# EasyEDA Pro project ProPrj_AUDIO CONTROLER_2026-01-01.epro, schematic Schematic1
Board Name: Board1; Create Date: 2025-12-11; Page Name: P1; Project Name: AUDIO CONTROLER; Schematic Name: Schematic1; Update Date: 2025-12-16; Company: EasyEDA.com; Page Size: A4; Version: V1.0
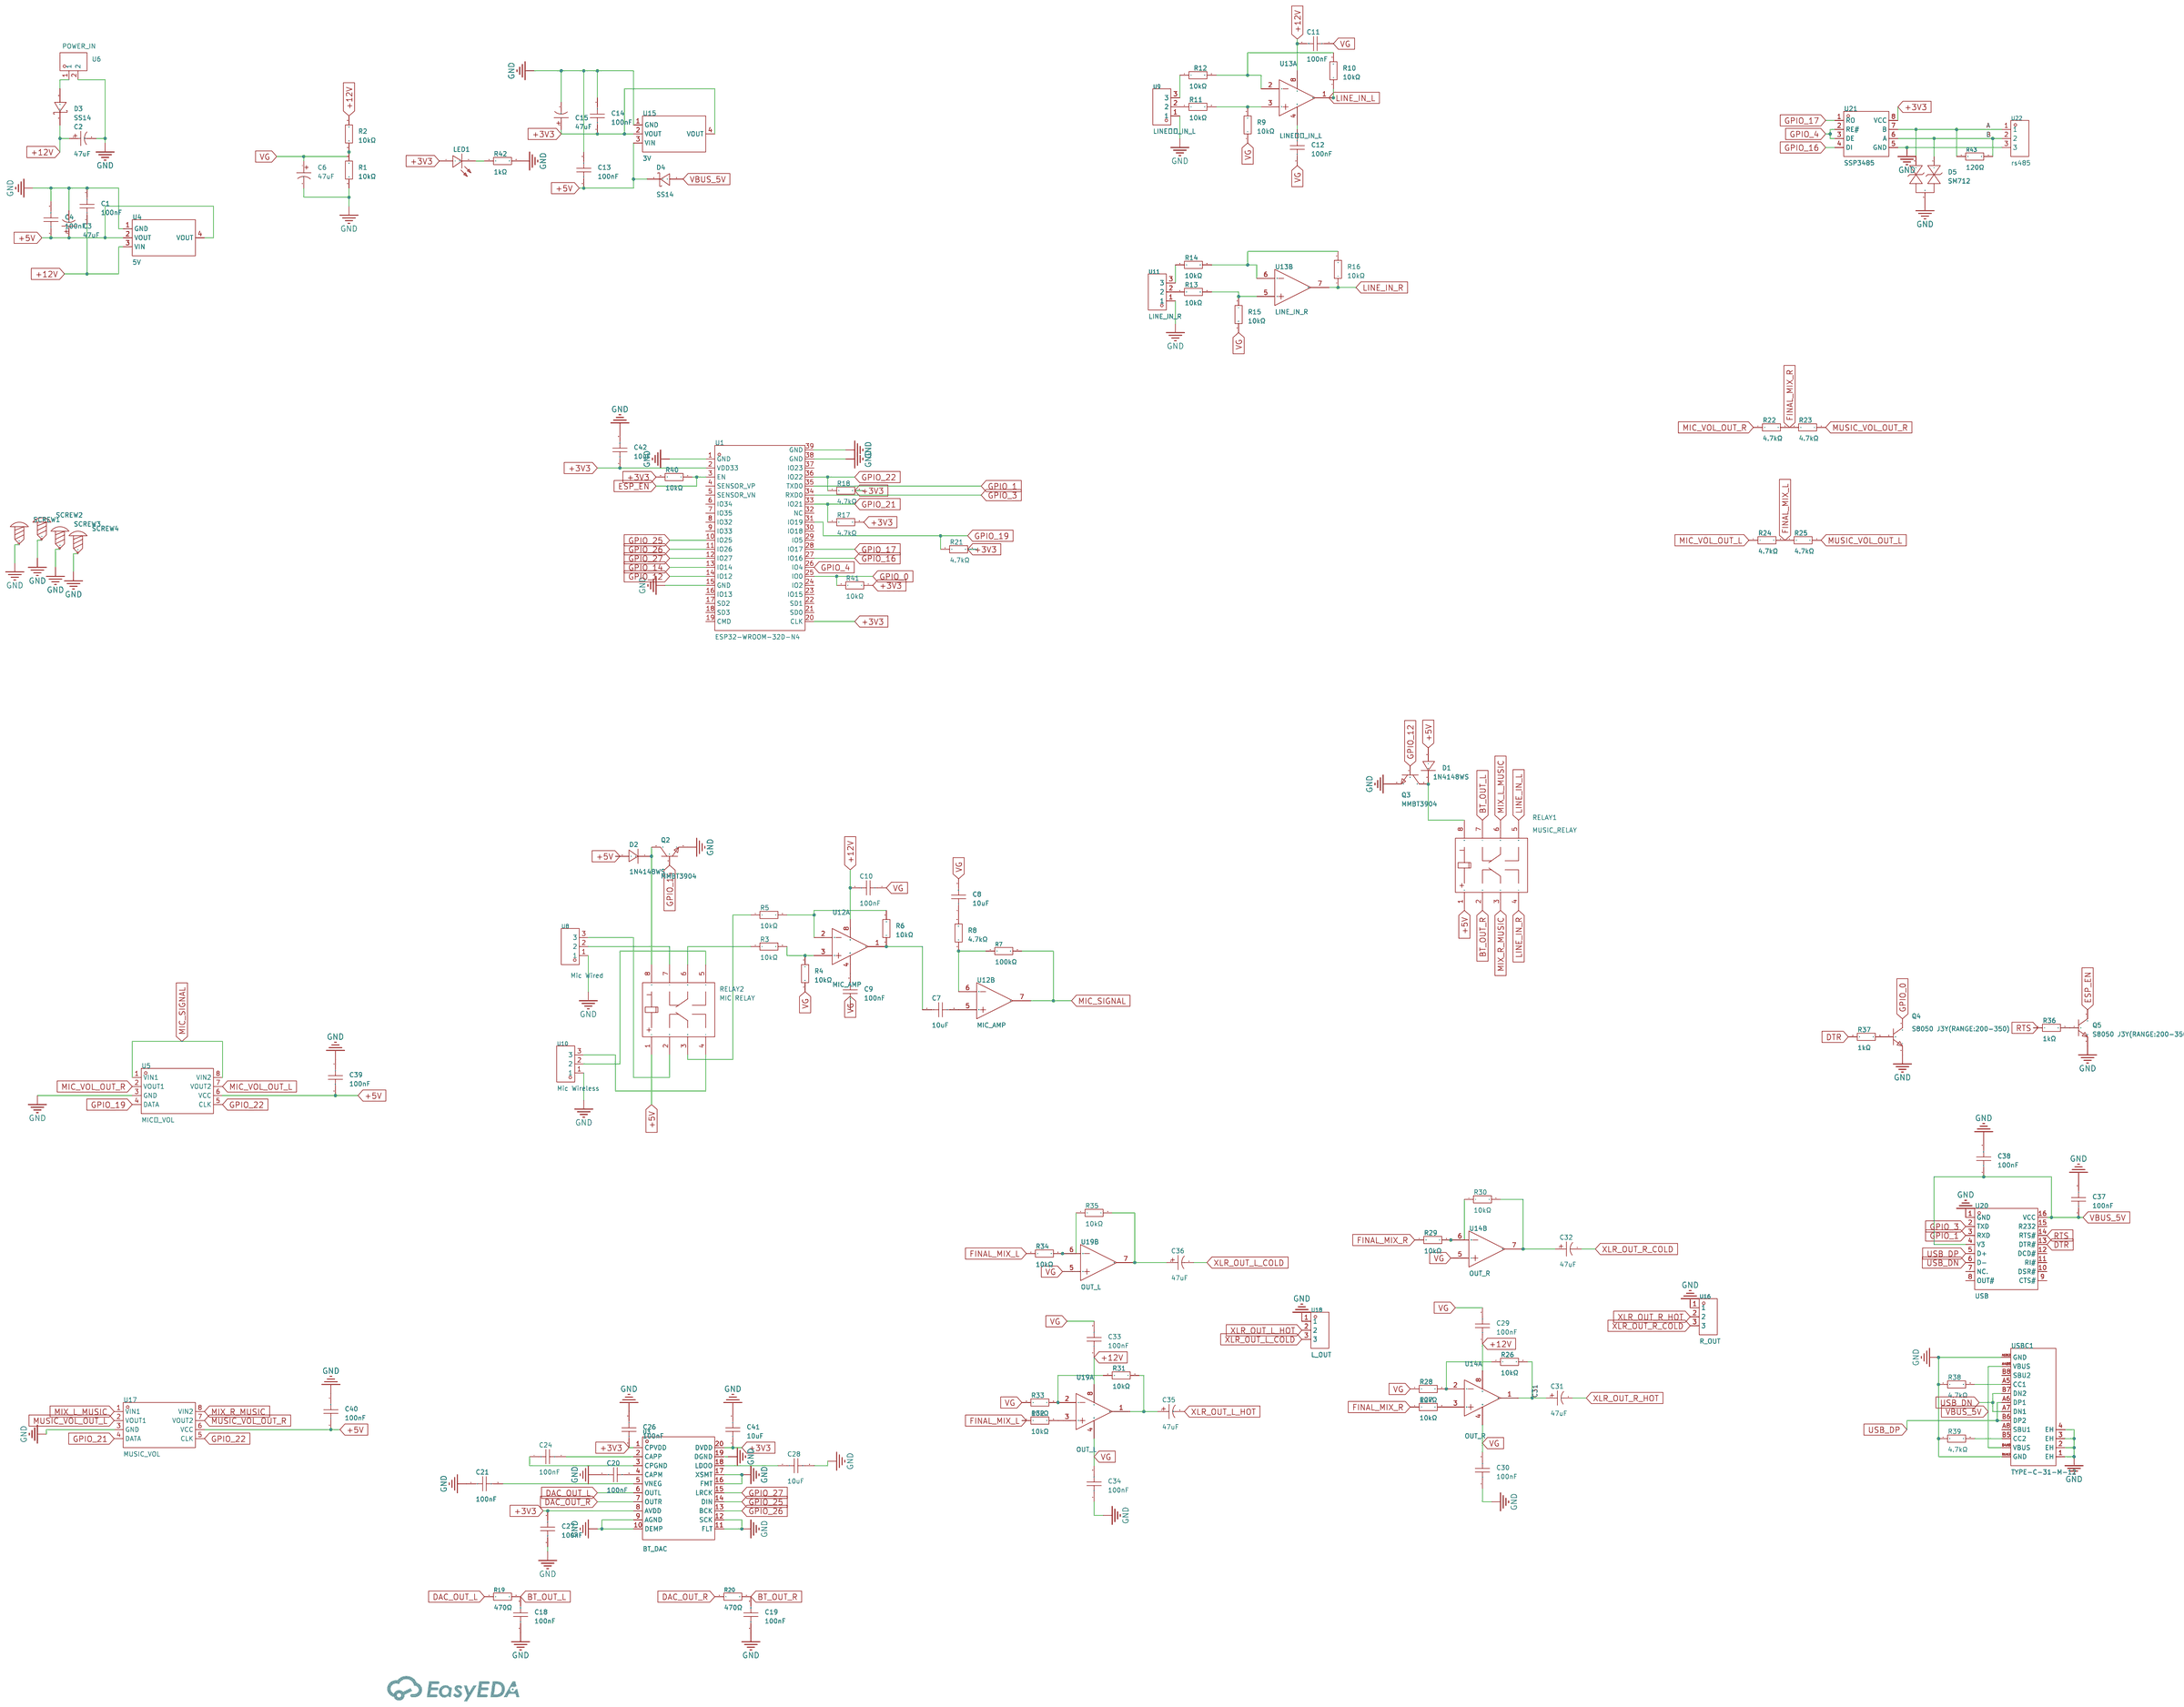
[diagram p0: schematic sheet]

## Parts
C1  100nF  [C0805]
C2  47uF  [CAP-SMD_BD6.3-L6.6-W6.6-LS7.6-FD]
C3  47uF  [CAP-SMD_BD6.3-L6.6-W6.6-LS7.6-FD]
C4  100nF  [C0805]
C6  47uF  [CAP-SMD_BD6.3-L6.6-W6.6-LS7.6-FD]
C7  10uF  [C0805]
C8  10uF  [C0805]
C9  100nF  [C0805]
C10  100nF  [C0805]
C11  100nF  [C0805]
C12  100nF  [C0805]
C13  100nF  [C0805]
C14  100nF  [C0805]
C15  47uF  [CAP-SMD_BD6.3-L6.6-W6.6-LS7.6-FD]
C18  100nF  [C0805]
C19  100nF  [C0805]
C20  100nF  [C0805]
C21  100nF  [C0805]
C24  100nF  [C0805]
C26  100nF  [C0805]
C27  100nF  [C0805]
C28  10uF  [C0805]
C29  100nF  [C0805]
C30  100nF  [C0805]
C31  47uF  [CAP-SMD_BD6.3-L6.6-W6.6-LS7.6-FD]
C32  47uF  [CAP-SMD_BD6.3-L6.6-W6.6-LS7.6-FD]
C33  100nF  [C0805]
C34  100nF  [C0805]
C35  47uF  [CAP-SMD_BD6.3-L6.6-W6.6-LS7.6-FD]
C36  47uF  [CAP-SMD_BD6.3-L6.6-W6.6-LS7.6-FD]
C37  100nF  [C0805]
C38  100nF  [C0805]
C39  100nF  [C0805]
C40  100nF  [C0805]
C41  10uF  [C0805]
C42  10uF  [C0805]
D1  1N4148WS  [SOD-323_L1.8-W1.3-LS2.5-RD]
D2  1N4148WS  [SOD-323_L1.8-W1.3-LS2.5-RD]
D3  SS14  [SMA_L4.2-W2.6-LS5.0-RD_1]
D4  SS14  [SMA_L4.2-W2.6-LS5.0-RD_1]
D5  SM712  [SOT-23-3_L2.9-W1.3-P1.90-LS2.4-BR]
LED1  KT-0603W  [LED0603-R-RD_WHITE]
Q2  MMBT3904  [SOT-23-3_L3.0-W1.7-P0.95-LS2.9-BR]
Q3  MMBT3904  [SOT-23-3_L3.0-W1.7-P0.95-LS2.9-BR]
Q4  S8050 J3Y(RANGE:200-350)  [SOT-23-3_L3.0-W1.7-P0.95-LS2.9-BR]
Q5  S8050 J3Y(RANGE:200-350)  [SOT-23-3_L3.0-W1.7-P0.95-LS2.9-BR]
R1  10kΩ  [R0805]
R2  10kΩ  [R0805]
R3  10kΩ  [R0805]
R4  10kΩ  [R0805]
R5  10kΩ  [R0805]
R6  10kΩ  [R0805]
R7  100kΩ  [R0805]
R8  4.7kΩ  [R0805]
R9  10kΩ  [R0805]
R10  10kΩ  [R0805]
R11  10kΩ  [R0805]
R12  10kΩ  [R0805]
R13  10kΩ  [R0805]
R14  10kΩ  [R0805]
R15  10kΩ  [R0805]
R16  10kΩ  [R0805]
R17  4.7kΩ  [R0805]
R18  4.7kΩ  [R0805]
R19  470Ω  [R0805]
R20  470Ω  [R0805]
R21  4.7kΩ  [R0805]
R22  4.7kΩ  [R0805]
R23  4.7kΩ  [R0805]
R24  4.7kΩ  [R0805]
R25  4.7kΩ  [R0805]
R26  10kΩ  [R0805]
R27  10kΩ  [R0805]
R28  10kΩ  [R0805]
R29  10kΩ  [R0805]
R30  10kΩ  [R0805]
R31  10kΩ  [R0805]
R32  10kΩ  [R0805]
R33  10kΩ  [R0805]
R34  10kΩ  [R0805]
R35  10kΩ  [R0805]
R36  1kΩ  [R0805]
R37  1kΩ  [R0805]
R38  4.7kΩ  [R0805]
R39  4.7kΩ  [R0805]
R40  10kΩ  [R0805]
R41  10kΩ  [R0805]
R42  1kΩ  [R0805]
R43  120Ω  [R0603]
RELAY1  MUSIC_RELAY  [RELAY-SMD_HFD4-5-SR]
RELAY2  MIC RELAY  [RELAY-SMD_HFD4-5-SR]
SCREW1  -  [Screw-Hole-M3]
SCREW2  -  [Screw-Hole-M3]
SCREW3  -  [Screw-Hole-M3]
SCREW4  -  [Screw-Hole-M3]
U1  ESP32-WROOM-32D-N4  [WIFIM-SMD_39P-L25.5-W18.0-P1.27-BL]
U3  BT_DAC  [TSSOP-20_L6.5-W4.4-P0.65-LS6.4-BL]
U4  5V  [SOT-223_L6.5-W3.5-P2.30-LS7.0-BR]
U5  MICֹ_VOL  [SOIC-8_L5.0-W4.0-P1.27-LS6.0-BL]
U6  POWER_IN  [CONN-TH_2P-P5.08_DB128L-5.08-2P]
U8  Mic Wired  [CONN-TH_3P-P5.08_KF129-5.08-3P]
U9  LINEֹֹ_IN_L  [CONN-TH_3P-P5.08_KF129-5.08-3P]
U10  Mic Wireless  [CONN-TH_3P-P5.08_KF129-5.08-3P]
U11  LINE_IN_R  [CONN-TH_3P-P5.08_KF129-5.08-3P]
U12  MIC_AMP  [SOIC-8_L4.9-W3.9-P1.27-LS6.0-BL]  (sections 1,2)
U13  LINEֹֹ_IN_L  [SOIC-8_L4.9-W3.9-P1.27-LS6.0-BL]  (sections 1,2)
U14  OUT_R  [SOIC-8_L4.9-W3.9-P1.27-LS6.0-BL]  (sections 1,2)
U15  3V  [SOT-223-3_L6.5-W3.4-P2.30-LS7.0-BR]
U16  R_OUT  [CONN-TH_3P-P5.08_KF129-5.08-3P]
U17  MUSIC_VOL  [SOIC-8_L5.0-W4.0-P1.27-LS6.0-BL]
U18  L_OUT  [CONN-TH_3P-P5.08_KF129-5.08-3P]
U19  OUT_L  [SOIC-8_L4.9-W3.9-P1.27-LS6.0-BL]  (sections 1,2)
U20  USB  [SOP-16_L10.0-W3.9-P1.27-LS6.0-BL]
U21  SSP3485  [SOP-8_L5.0-W3.9-P1.27-LS6.0-BL]
U22  rs485  [CONN-TH_3P-P5.08_KF129-5.08-3P]
USBC1  TYPE-C-31-M-12  [USB-C_SMD-TYPE-C-31-M-12_1]

## Library data of the parts
C1 C4 C9-C14 C18-C21 C24 C26 C27 C29 C30 C33 C34 C37-C40 = CC0805KRX7R9BB104: Capacitance:100nF Tolerance:±10% Tolerance:±10% Voltage Rating:50V Temperature Coefficient:X7R; LCSC Part Name: 100nF ±10% 50V; Supplier Part: C49678; Manufacturer: YAGEO(国巨); Supplier Footprint: 0805; JLCPCB Part Class: Basic Part; Datasheet: https://item.szlcsc.com/datasheet/CC0805KRX7R9BB104/50686.html; Supplier: LCSC; Tolerance: ±10%; Voltage Rating: 50V; Temperature Coefficient: X7R
C2 C3 C6 C15 C31 C32 C35 C36 = RVT1H470M0607_C72523: Capacitance:47uF Tolerance:±20% Tolerance:±20% Voltage Rating:50V Ripple Current:66mA@120Hz Equivalent Series Resistance(ESR):- Diameter:6.3mm Height - Seated (Max):7.7mm Lifetime:2000hrs@105℃ Operating Temperature:-40℃~+105℃ Operating Temperature:-40℃~+1; LCSC Part Name: 47uF ±20% 50V; Supplier Part: C72523; Manufacturer: ROQANG(容强); Manufacturer Part: RVT1H470M0607; Supplier Footprint: SMD,D6.3xL7.7mm; JLCPCB Part Class: Extended Part; Datasheet: https://item.szlcsc.com/datasheet/RVT1H470M0607/73634.html; Supplier: LCSC; Tolerance: ±20%; Voltage Rating: 50V; Ripple Current: 66mA@120Hz; Diameter: 6.3mm; Height - Seated (Max): 7.7mm; Lifetime: 2000hrs@105℃; Operating Temperature: -40℃~+105℃
C7 C8 C28 C41 C42 = CL21A106KAYNNNE_C15850: Capacitance:10uF Tolerance:±10% Tolerance:±10% Voltage Rating:25V Temperature Coefficient:X5R; LCSC Part Name: 10uF ±10% 25V; Supplier Part: C15850; Manufacturer: SAMSUNG(三星); Manufacturer Part: CL21A106KAYNNNE; Supplier Footprint: 0805; JLCPCB Part Class: Basic Part; Datasheet: https://item.szlcsc.com/datasheet/CL21A106KAYNNNE/16532.html; Supplier: LCSC; Tolerance: ±10%; Voltage Rating: 25V; Temperature Coefficient: X5R
D1 D2 = 1N4148WS_C110221: Diode Configuration:Independent Voltage - Forward(Vf@If):1.25V@150mA Voltage - DC Reverse(Vr):75V Current - Rectified:150mA Pd - Power Dissipation:200mW Reverse Leakage Current (Ir):1uA@75V Reverse Recovery Time (trr):4ns Operating Junction Temperature Ra; LCSC Part Name: 75V 150mA; Supplier Part: C110221; Manufacturer: SHIKUES(时科); Supplier Footprint: SOD-323; JLCPCB Part Class: Extended Part; Datasheet: https://item.szlcsc.com/datasheet/1N4148WS/111442.html; Supplier: LCSC; Diode Configuration: Independent; Voltage - Forward(Vf@If): 1.25V@150mA; Voltage - DC Reverse(Vr): 75V; Current - Rectified: 150mA; Pd - Power Dissipation: 200mW; Reverse Leakage Current (Ir): 1uA@75V; Reverse Recovery Time (trr): 4ns; Operating Junction Temperature Range: -65℃~+150℃@(Tj); Non-Repetitive Peak Forward Surge Current: 12A
D3 D4 = SS14_C2480: Diode Configuration:Independent Voltage - Forward(Vf@If):550mV@1A Voltage - DC Reverse(Vr):40V Current - Rectified:1A Reverse Leakage Current (Ir):300uA@40V Operating Junction Temperature Range:-55℃~+150℃ Operating Junction Temperature Range:-55℃~+150℃ No; LCSC Part Name: 电压:40V 电流:1A; Supplier Part: C2480; Manufacturer: MDD(辰达半导体); Supplier Footprint: SMA(DO-214AC); JLCPCB Part Class: Basic Part; Datasheet: https://item.szlcsc.com/datasheet/SS14/2857.html; Supplier: LCSC; Diode Configuration: Independent; Voltage - Forward(Vf@If): 550mV@1A; Voltage - DC Reverse(Vr): 40V; Current - Rectified: 1A; Reverse Leakage Current (Ir): 300uA@40V; Operating Junction Temperature Range: -55℃~+150℃; Non-Repetitive Peak Forward Surge Current: 25A
D5 = SM712_C908219: Polarity:Bidirectional Reverse Stand-Off Voltage (Vrwm):7V Clamping Voltage:20V Peak Pulse Current (Ipp):18A Peak Pulse Power Dissipation (Ppp):360W Voltage - Breakdown:13.3V Reverse Leakage Current (Ir):1uA Number of Channels:2 Operating Temperature:-55℃; LCSC Part Name: 双向ESD 7V截止 峰值浪涌电流：18A; Supplier Part: C908219; Manufacturer: FUXINSEMI(富芯森美); Supplier Footprint: SOT-23; JLCPCB Part Class: Extended Part; Datasheet: https://item.szlcsc.com/datasheet/SM712/974461.html; Supplier: LCSC; Polarity: Bidirectional; Reverse Stand-Off Voltage (Vrwm): 7V; Clamping Voltage: 20V; Peak Pulse Current (Ipp): 18A; Peak Pulse Power Dissipation (Ppp): 360W; Voltage - Breakdown: 13.3V; Reverse Leakage Current (Ir): 1uA; Number of Channels: 2; Operating Temperature: -55℃~+125℃; level of protection: IEC 61000-4-5；IEC 61000-4-2; Type: ESD; Junction Capacitance: 45pF
LED1 = KT-0603W: Illumination Color:White Voltage - Forward(Vf):2.6V~3.1V Voltage - Forward(Vf):2.6V~3.1V Power(Watts):100mW Forward Current:5mA Diode Configuration:Discrete Diode Lens Color:Yellow Lens Luminous Intensity:360mcd Luminous Intensity:360mcd Viewing Angle:120; LCSC Part Name: 0603 白灯 高亮; Supplier Part: C2290; Manufacturer: KENTO; Supplier Footprint: 0603; JLCPCB Part Class: Basic Part; Datasheet: https://item.szlcsc.com/datasheet/KT-0603W/2663.html; Supplier: LCSC; Illumination Color: White; Voltage - Forward(Vf): 2.6V~3.1V; Power(Watts): 100mW; Forward Current: 5mA; Diode Configuration: Discrete Diode; Lens Color: Yellow Lens; Luminous Intensity: 360mcd; Viewing Angle: 120°; Mounting Style: op View Mount
Q2 Q3 = MMBT3904_C108429: type:NPN Current - Collector(Ic):200mA Collector - Emitter Voltage VCEO:40V Pd - Power Dissipation:250mW DC Current Gain:60@0.1mA,1V DC Current Gain:60@0.1mA,1V Transition frequency(fT):300MHz Current - Collector Cutoff:50nA Vce Saturation(VCE(sat)):200mV; LCSC Part Name: NPN 电流:200mA 电压:40V; Supplier Part: C108429; Manufacturer: Nexperia(安世); Supplier Footprint: SOT-23; JLCPCB Part Class: Extended Part; Datasheet: https://item.szlcsc.com/datasheet/MMBT3904/109648.html; Supplier: LCSC; type: NPN; Current - Collector(Ic): 200mA; Collector - Emitter Voltage VCEO: 40V; Pd - Power Dissipation: 250mW; DC Current Gain: 60@0.1mA,1V; Transition frequency(fT): 300MHz; Current - Collector Cutoff: 50nA; Vce Saturation(VCE(sat)): 200mV; Operating Temperature: -65℃~+150℃; Emitter-Base Voltage(Vebo): 6V; Number: 1 NPN
Q4 Q5 = S8050 J3Y(RANGE:200-350): type:NPN Current - Collector(Ic):500mA Collector - Emitter Voltage VCEO:25V Pd - Power Dissipation:300mW DC Current Gain:200@500mA,1V DC Current Gain:200@500mA,1V Transition frequency(fT):150MHz Current - Collector Cutoff:100nA Vce Saturation(VCE(sat)):60; LCSC Part Name: H档(200-350) NPN 电流:0.5A 电压:25V; Supplier Part: C2146; Manufacturer: CJ(江苏长电/长晶); Supplier Footprint: SOT-23; JLCPCB Part Class: Basic Part; Datasheet: https://item.szlcsc.com/datasheet/S8050%2520J3Y(RANGE%253A200-350)/2503.html; Supplier: LCSC; type: NPN; Current - Collector(Ic): 500mA; Collector - Emitter Voltage VCEO: 25V; Pd - Power Dissipation: 300mW; DC Current Gain: 200@500mA,1V; Transition frequency(fT): 150MHz; Current - Collector Cutoff: 100nA; Vce Saturation(VCE(sat)): 600mV@500mA,50mA; Operating Temperature: -55℃~+150℃; Emitter-Base Voltage(Vebo): 5V; Number: 1 NPN
R1-R6 R9-R16 R26-R35 R40 R41 = 0805W8F1002T5E: Type:Thick Film Resistor Resistance:10kΩ Tolerance:±1% Tolerance:±1% Power(Watts):125mW Voltage-Supply(Max):150V Temperature Coefficient:±100ppm/℃ Temperature Coefficient:±100ppm/℃ Operating Temperature:-55℃~+155℃ Operating Temperature:-55℃~+155℃; LCSC Part Name: 10kΩ ±1% 125mW 厚膜电阻; Supplier Part: C17414; Manufacturer: UNI-ROYAL(厚声); Supplier Footprint: 0805; JLCPCB Part Class: Basic Part; Datasheet: https://item.szlcsc.com/datasheet/0805W8F1002T5E/18102.html; Supplier: LCSC; Type: Thick Film Resistor; Tolerance: ±1%; Power(Watts): 125mW; Voltage-Supply(Max): 150V; Temperature Coefficient: ±100ppm/℃; Operating Temperature: -55℃~+155℃
R7 = 0805W8F1003T5E: Type:Thick Film Resistor Resistance:100kΩ Tolerance:±1% Tolerance:±1% Power(Watts):125mW Voltage-Supply(Max):150V Temperature Coefficient:±100ppm/℃ Temperature Coefficient:±100ppm/℃ Operating Temperature:-55℃~+155℃ Operating Temperature:-55℃~+155℃; LCSC Part Name: 100kΩ ±1% 125mW 厚膜电阻; Supplier Part: C149504; Manufacturer: UNI-ROYAL(厚声); Supplier Footprint: 0805; JLCPCB Part Class: Basic Part; Datasheet: https://item.szlcsc.com/datasheet/0805W8F1003T5E/160838.html; Supplier: LCSC; Type: Thick Film Resistor; Tolerance: ±1%; Power(Watts): 125mW; Voltage-Supply(Max): 150V; Temperature Coefficient: ±100ppm/℃; Operating Temperature: -55℃~+155℃
R8 R17 R18 R21-R25 R38 R39 = 0805W8F4701T5E: Type:Thick Film Resistors Resistance:4.7kΩ Tolerance:±1% Tolerance:±1% Power(Watts): Overload Voltage (Max): Temperature Coefficient:±100ppm/℃ Temperature Coefficient:±100ppm/℃ Operating Temperature Range:-55℃~+155℃ Operating Temperature Range:-55℃~+155℃; LCSC Part Name: 4.7kΩ ±1% 125mW 厚膜电阻; Supplier Part: C17673; Manufacturer: UNI-ROYAL(厚声); Supplier Footprint: 0805; JLCPCB Part Class: Basic Part; Datasheet: https://atta.szlcsc.com/upload/public/pdf/source/20200306/C422600_1E6D84923E4A46A82E41ADD87F860B5C.pdf; Supplier: LCSC; Type: Thick Film Resistors; Tolerance: ±1%; Temperature Coefficient: ±100ppm/℃; Operating Temperature Range: -55℃~+155℃
R19 R20 = 0805W8F4700T5E: Type:Thick Film Resistor Resistance:470Ω Tolerance:±1% Tolerance:±1% Power(Watts):125mW Voltage-Supply(Max):150V Temperature Coefficient:±100ppm/℃ Temperature Coefficient:±100ppm/℃ Operating Temperature:-55℃~+155℃ Operating Temperature:-55℃~+155℃; LCSC Part Name: 470Ω ±1% 125mW 厚膜电阻; Supplier Part: C17710; Manufacturer: UNI-ROYAL(厚声); Supplier Footprint: 0805; JLCPCB Part Class: Basic Part; Datasheet: https://item.szlcsc.com/datasheet/0805W8F4700T5E/18398.html; Supplier: LCSC; Type: Thick Film Resistor; Tolerance: ±1%; Power(Watts): 125mW; Voltage-Supply(Max): 150V; Temperature Coefficient: ±100ppm/℃; Operating Temperature: -55℃~+155℃
R36 R37 R42 = 0805W8F1001T5E: Type:Thick Film Resistors Resistance:1kΩ Tolerance:±1% Tolerance:±1% Power(Watts): Overload Voltage (Max): Temperature Coefficient:±100ppm/℃ Temperature Coefficient:±100ppm/℃ Operating Temperature Range:-55℃~+155℃ Operating Temperature Range:-55℃~+155℃; LCSC Part Name: 1kΩ ±1% 125mW 厚膜电阻; Supplier Part: C17513; Manufacturer: UNI-ROYAL(厚声); Supplier Footprint: 0805; JLCPCB Part Class: Basic Part; Datasheet: https://atta.szlcsc.com/upload/public/pdf/source/20200306/C422600_1E6D84923E4A46A82E41ADD87F860B5C.pdf; Supplier: LCSC; Type: Thick Film Resistors; Tolerance: ±1%; Temperature Coefficient: ±100ppm/℃; Operating Temperature Range: -55℃~+155℃
R43 = 0603WAF1200T5E: Type:Thick Film Resistor Resistance:120Ω Tolerance:±1% Tolerance:±1% Power(Watts):100mW Voltage-Supply(Max):75V Temperature Coefficient:±100ppm/℃ Temperature Coefficient:±100ppm/℃ Operating Temperature:-55℃~+155℃ Operating Temperature:-55℃~+155℃; LCSC Part Name: 120Ω ±1% 100mW 厚膜电阻; Supplier Part: C22787; Manufacturer: UNI-ROYAL(厚声); Supplier Footprint: 0603; JLCPCB Part Class: Basic Part; Datasheet: https://item.szlcsc.com/datasheet/0603WAF1200T5E/23514.html; Supplier: LCSC; Type: Thick Film Resistor; Tolerance: ±1%; Power(Watts): 100mW; Voltage-Supply(Max): 75V; Temperature Coefficient: ±100ppm/℃; Operating Temperature: -55℃~+155℃
RELAY1 RELAY2 = HFD4/5-SR: Coil Voltage:5V Contact Form:2 Form C: 2C (DPDT-CO) Number of Pins:8 Contact Rating:1A@30VDC；300mA@125VAC Switching Voltage(Max):250V@AC；220V@DC Contact Material:AgNi + Gold plated Coil Rated Power:140mW Coil Resistance:178Ω Switching Current(Max):2A Oper; LCSC Part Name: 超小型5V继电器 双刀双掷; Supplier Part: C64399; Manufacturer: HF(宏发); Supplier Footprint: SMD,10x6.5mm; JLCPCB Part Class: Extended Part; Datasheet: https://item.szlcsc.com/datasheet/HFD4%252F5-SR/65466.html; Supplier: LCSC; Coil Voltage: 5V; Contact Form: 2 Form C: 2C (DPDT-CO); Number of Pins: 8; Contact Rating: 1A@30VDC；300mA@125VAC; Switching Voltage(Max): 250V@AC；220V@DC; Contact Material: AgNi + Gold plated; Coil Rated Power: 140mW; Coil Resistance: 178Ω; Switching Current(Max): 2A; Operate Time: 3ms; Release Time: 3ms; Coil Type: Polarized-Single Coil; Contact Resistance: 100mΩ; Operating Temperature: -40℃~+85℃
SCREW1-SCREW4 = Screw-Hole-M3: Supplier Footprint: 插件
U1 = ESP32-WROOM-32D-N4: LCSC Part Name: 通用型Wi-Fi+BT+BLE MCU模组; Supplier Part: C473012; Manufacturer: ESPRESSIF(乐鑫); Supplier Footprint: SMD,18x25.5mm; JLCPCB Part Class: Extended Part; Datasheet: https://atta.szlcsc.com/upload/public/pdf/source/20191225/C473012_1E74417EE995DBCF17C94BD318A37DAB.pdf; Supplier: LCSC
U3 = PCM5102APWR: Interface Type:PCM Supply Voltage:1.65V~3.46V Supply Voltage:1.65V~3.46V Number of Channels:2 Resolution:24；16；32 Operating Temperature:-25℃~+85℃ Operating Temperature:-25℃~+85℃; Supplier Part: C107671; Manufacturer: TI(德州仪器); Supplier Footprint: TSSOP-20; JLCPCB Part Class: Extended Part; Datasheet: https://www.ti.com/cn/lit/gpn/pcm5102a; Supplier: LCSC; Interface Type: PCM; Supply Voltage: 1.65V~3.46V; Number of Channels: 2; Resolution: 24；16；32; Operating Temperature: -25℃~+85℃
U4 = AMS1117-5.0_C6187: Output Type:Fixed Voltage - Supply:15V Output Voltage:5V Output Voltage:5V Output Current:1A Power Supply Rejection Ratio (PSRR):60dB Voltage Dropout:1.3V standby current:- Noise:- Features:- Operating Temperature:-40℃~+125℃ Operating Temperature:-40℃~+12; LCSC Part Name: 输入15V 输出5V 1A; Supplier Part: C6187; Manufacturer: AMS; Supplier Footprint: SOT-223; JLCPCB Part Class: Basic Part; Datasheet: https://item.szlcsc.com/datasheet/AMS1117-5.0/6653.html; Supplier: LCSC; Output Type: Fixed; Voltage - Supply: 15V; Output Current: 1A; Power Supply Rejection Ratio (PSRR): 60dB; Voltage Dropout: 1.3V; Operating Temperature: -40℃~+125℃; Output Configuration: Positive; Number of Outputs: 1
U5 U17 = M62429: Type:Volume Control Voltage - Supply:4V~6V Voltage - Supply:4V~6V Operating Temperature:-20℃~+75℃ Operating Temperature:-20℃~+75℃; Supplier Part: C668665; Manufacturer: I-CORE(中微爱芯); Supplier Footprint: SOP-8; JLCPCB Part Class: Extended Part; Datasheet: https://item.szlcsc.com/datasheet/M62429/699302.html; Supplier: LCSC; Type: Volume Control; Voltage - Supply: 4V~6V; Operating Temperature: -20℃~+75℃
U6 = DB128L-5.08-2P-GN-S: Number of Positions or Pins:1x2P Pitch:5.08mm Color:Green Mounting Type:Through Hole Number of Pins:2P Number of Rows:1 Number of PINs Per Row:2 Screw Specification:M2 Current Rating:16A Voltage Rating (Max):300V Wire Gauge - AWG:12~22 Wire Gauge - AWG:12; LCSC Part Name: 1x2P 5.08mm 直插 排数:1 每排P数:2; Supplier Part: C395868; Manufacturer: DORABO(地博电气); Supplier Footprint: 插件,P=5.08mm; JLCPCB Part Class: Extended Part; Datasheet: https://item.szlcsc.com/datasheet/DB128L-5.08-2P-GN-S/376615.html; Supplier: LCSC; Number of Positions or Pins: 1x2P; Pitch: 5.08mm; Color: Green; Mounting Type: Through Hole; Number of Pins: 2P; Number of Rows: 1; Number of PINs Per Row: 2; Screw Specification: M2; Current Rating: 16A; Voltage Rating (Max): 300V; Wire Gauge - AWG: 12~22; Wire Gauge - mm2: 2.5; Operating Temperature: -40℃~+105℃
U8-U11 U16 U18 U22 = KF129-5.08-3P: Structure:1x3P Pitch:5.08mm Color:Green Mounting Style:Straight Current Rating (Max):24A Voltage Rating (Max):250V Number of Pins:3P Number of Rows:1 Wire Gauge - AWG:12~24 Wire Gauge - AWG:12~24 Wire Gauge - mm2:2.5 Wire Gauge - mm2:2.5 Number of PINs Pe; LCSC Part Name: 5.08mm 1x3P 排数:1 每排P数:3 直插; Supplier Part: C475093; Manufacturer: KEFA(科发); Supplier Footprint: 插件,P=5.08mm; JLCPCB Part Class: Extended Part; Datasheet: https://atta.szlcsc.com/upload/public/pdf/source/20230317/C51F4E571BB6AC420100489776F9C24F.pdf; Supplier: LCSC; Structure: 1x3P; Pitch: 5.08mm; Color: Green; Mounting Style: Straight; Current Rating (Max): 24A; Voltage Rating (Max): 250V; Number of Pins: 3P; Number of Rows: 1; Wire Gauge - AWG: 12~24; Wire Gauge - mm2: 2.5; Number of PINs Per Row: 3; Operating Temperature Range: -40℃~+105℃
U12-U14 U19 = NE5532DR: Number of Channels:2 Maximum Power Supply Range (Vdd-Vss):30V Rail to Rail:- Gain Bandwidth Product:10MHz Vos - Input Offset Voltage:500uV Input Offset Voltage Drift(Vos TC):5uV/℃ Slew Rate:9V/us Ib - Input Bias Current:1uA Input Offset Current(Ios):10nA; LCSC Part Name: 低噪声双运算放大器; Supplier Part: C7426; Manufacturer: TI(德州仪器); Supplier Footprint: SOIC-8; JLCPCB Part Class: Basic Part; Datasheet: http://www.ti.com/cn/lit/gpn/ne5532; Supplier: LCSC; Number of Channels: 2; Maximum Power Supply Range (Vdd-Vss): 30V; Gain Bandwidth Product: 10MHz; Vos - Input Offset Voltage: 500uV; Input Offset Voltage Drift(Vos TC): 5uV/℃; Slew Rate: 9V/us; Ib - Input Bias Current: 1uA; Input Offset Current(Ios): 10nA; Noise density(eN): 5nV/√Hz@1kHz; Common Mode Rejection Ratio(CMRR): 100dB; Quiescent Current: 16mA; Output Current: 38mA; Operating Temperature: 0℃~+70℃; Dual Supply: -15V~15V
U15 = AMS1117-3.3_C6186: Output Type:Fixed Voltage - Supply:16V Output Voltage:3.3V Output Voltage:3.3V Output Current:1A Power Supply Rejection Ratio (PSRR):72dB@(120Hz) Voltage Dropout:1.1V@(800mA) standby current:5mA Noise:0.003%Vout Features:Over Current Protection；Over Tempe; LCSC Part Name: 输出3.3V 1A; Supplier Part: C6186; Manufacturer: AMS; Supplier Footprint: SOT-223; JLCPCB Part Class: Basic Part; Datasheet: https://item.szlcsc.com/datasheet/AMS1117-3.3/6652.html; Supplier: LCSC; Output Type: Fixed; Voltage - Supply: 16V; Output Voltage: 3.3V; Output Current: 1A; Power Supply Rejection Ratio (PSRR): 72dB@(120Hz); Voltage Dropout: 1.1V@(800mA); standby current: 5mA; Noise: 0.003%Vout; Features: Over Current Protection；Over Temperature Protection; Operating Temperature: -40℃~+125℃; Output Configuration: Positive; Number of Outputs: 1
U20 = CH340C: Applications Function:Transceiver USB Protocol:USB 2.0 Voltage - Supply:3.3V；5V Voltage - Supply:3.3V；5V Data Rate:2Mbps Operating Temperature:-20℃~+70℃ Operating Temperature:-20℃~+70℃ Current - Supply:7mA Supply Current (Iq):50uA; LCSC Part Name: USB转串口芯片; Supplier Part: C84681; Manufacturer: WCH(南京沁恒); Supplier Footprint: SOP-16; JLCPCB Part Class: Extended Part; Datasheet: https://item.szlcsc.com/datasheet/CH340C/85852.html; Supplier: LCSC; Applications Function: Transceiver; USB Protocol: USB 2.0; Voltage - Supply: 3.3V；5V; Data Rate: 2Mbps; Operating Temperature: -20℃~+70℃; Current - Supply: 7mA; Supply Current (Iq): 50uA
U21 = SSP3485: Type:Transceiver Number of Drivers:1 Number of Receivers:1 Voltage - Supply:5V Voltage - Supply:5V Data Rate:10Mbps Data Rate:10Mbps Number of Nodes:256 ESD Protect:±15kV ESD Protect:±15kV Operating Temperature:-40℃~+85℃ Operating Temperature:-40℃~+85℃ Su; LCSC Part Name: 具备+15kV ESD保护、10Mbps数据速率的RS-485接口; Supplier Part: C2845064; Manufacturer: Siproin(上海矽朋); Supplier Footprint: SOP-8; JLCPCB Part Class: Extended Part; Datasheet: https://item.szlcsc.com/datasheet/SSP3485/3037969.html; Supplier: LCSC; Type: Transceiver; Number of Drivers: 1; Number of Receivers: 1; Voltage - Supply: 5V; Data Rate: 10Mbps; Number of Nodes: 256; ESD Protect: ±15kV; Operating Temperature: -40℃~+85℃; Supply Current (Iq): 450uA; Communication Mode: Half-Duplex
USBC1 = TYPE-C-31-M-12: Connector Type:Type-C Protocol Standard:- Gender:Female Mounting Type:- Number of Contacts:16P Number of Ports:1 Current Rating-Power:5A Operating Temperature:- Operating Temperature:-; LCSC Part Name: Type-C 母; Supplier Part: C165948; Manufacturer: 韩国韩荣; Supplier Footprint: SMD; JLCPCB Part Class: Extended Part; Datasheet: https://item.szlcsc.com/datasheet/TYPE-C-31-M-12/177331.html; Supplier: LCSC; Connector Type: Type-C; Gender: Female; Number of Contacts: 16P; Number of Ports: 1; Current Rating-Power: 5A

## Nets
+3V3: C14.1 C15.1 C26.1 C27.2 C41.1 C42.1 LED1.1(A) R17.2 R18.2 R21.2 R40.2 R41.1 U1.2(VDD33) U1.20(CLK) U3.1(CPVDD) U3.8(AVDD) U3.20(DVDD) U15.2(VOUT) U15.4(VOUT) U21.8(VCC)
+5V: C3.1 C4.1 C13.1 C39.2 C40.2 D1.2(A) D2.2(A) D4.1(K) RELAY1.1 RELAY2.1 U4.2(VOUT) U4.4(VOUT) U5.6(VCC) U15.3(VIN) U17.6(VCC)
+12V: C1.1 C2.1 C10.2 C11.2 C29.1 C33.1 D3.1(K) R2.2 U4.3(VIN) U12.8(VCC+) U13.8(VCC+) U14.8(VCC+) U19.8(VCC+)
GND: C1.2 C2.2 C3.2 C4.2 C6.2 C13.2 C14.2 C15.2 C18.1 C19.1 C20.1 C21.1 C26.2 C27.1 C28.2 C30.1 C34.1 C37.2 C38.2 C39.1 C40.1 C41.2 C42.2 D5.3 Q2.2(E) Q3.2(E) Q4.2(E) Q5.2(E) R1.1 R38.1 R39.1 R42.2 SCREW1.1 SCREW2.1 SCREW3.1 SCREW4.1 U1.1(GND) U1.15(GND) U1.38(GND) U1.39(GND) U3.9(AGND) U3.10(DEMP) U3.11(FLT) U3.12(SCK) U3.16(FMT) U3.17(XSMT) U3.19(DGND) U4.1(GND) U5.3(GND) U6.2 U8.1 U9.1 U10.1 U11.1 U15.1(GND) U16.1 U17.3(GND) U18.1 U20.1(GND) U21.5(GND) U22.3 USBC1.1(EH) USBC1.2(EH) USBC1.3(EH) USBC1.4(EH) USBC1.A1B12(GND) USBC1.B1A12(GND)
VBUS_5V: C37.1 C38.1 D4.2(A) U20.4(V3) U20.16(VCC) USBC1.A4B9(VBUS) USBC1.B4A9(VBUS)
A: D5.2 R43.1 U21.7(B) U22.1
B: D5.1 R43.2 U21.6(A) U22.2
BT_OUT_L: C18.2 R19.2 RELAY1.7
BT_OUT_R: C19.2 R20.2 RELAY1.2
C31: C31.1 R26.2 U14.1(OUT1)
DAC_OUT_L: R19.1 U3.6(OUTL)
DAC_OUT_R: R20.1 U3.7(OUTR)
DTR: R37.1 U20.13(DTR#)
ESP_EN: Q5.3(C) R40.1 U1.3(EN)
FINAL_MIX_L: R24.2 R25.1 R32.1 R34.1
FINAL_MIX_R: R22.2 R23.2 R27.1 R29.1
GPIO_0: Q4.3(C) R41.2 U1.25(IO0)
GPIO_1: U1.35(TXD0) U20.3(RXD)
GPIO_3: U1.34(RXD0) U20.2(TXD)
GPIO_4: U1.26(IO4) U21.2(RE#) U21.3(DE)
GPIO_12: Q3.1(B) U1.14(IO12)
GPIO_14: Q2.1(B) U1.13(IO14)
GPIO_16: U1.27(IO16) U21.4(DI)
GPIO_17: U1.28(IO17) U21.1(RO)
GPIO_19: R21.1 U1.31(IO19) U5.4(DATA)
GPIO_21: R17.1 U1.33(IO21) U17.4(DATA)
GPIO_22: R18.1 U1.36(IO22) U5.5(CLK) U17.5(CLK)
GPIO_25: U1.10(IO25) U3.14(DIN)
GPIO_26: U1.11(IO26) U3.13(BCK)
GPIO_27: U1.12(IO27) U3.15(LRCK)
LINE_IN_L: R10.1 RELAY1.5 U13.1(OUT1)
LINE_IN_R: R16.1 RELAY1.4 U13.7(OUT2)
MIC_SIGNAL: R7.2 U5.1(VIN1) U5.8(VIN2) U12.7(OUT2)
MIC_VOL_OUT_L: R24.1 U5.7(VOUT2)
MIC_VOL_OUT_R: R22.1 U5.2(VOUT1)
MIX_L_MUSIC: RELAY1.6 U17.1(VIN1)
MIX_R_MUSIC: RELAY1.3 U17.8(VIN2)
MUSIC_VOL_OUT_L: R25.2 U17.2(VOUT1)
MUSIC_VOL_OUT_R: R23.1 U17.7(VOUT2)
NET17: C12.1 U13.4(VCC-/GND)
RTS: R36.1 U20.14(RTS#)
USB_DN: U20.6(D-) USBC1.A7(DN1) USBC1.B7(DN2)
USB_DP: U20.5(D+) USBC1.A6(DP1) USBC1.B6(DP2)
VG: C6.1 C8.2 C9.1 C10.1 C11.1 C12.2 C29.2 C30.2 C33.2 C34.2 R1.2 R2.1 R4.1 R9.1 R15.2 R28.1 R33.1 U14.4(VCC-/GND) U14.5(IN2+) U19.4(VCC-/GND) U19.5(IN2+)
XLR_OUT_L_COLD: C36.2 U18.3
XLR_OUT_L_HOT: C35.2 U18.2
XLR_OUT_R_COLD: C32.2 U16.3
XLR_OUT_R_HOT: C31.2 U16.2
$1N5041: R3.2 R4.2 U12.3(IN1+)
$1N5114: R5.2 R6.2 U12.2(IN1-)
$1N5155: C7.1 R6.1 U12.1(OUT1)
$1N5236: C7.2 U12.5(IN2+)
$1N5340: R7.1 R8.1 U12.6(IN2-)
$1N5451: C8.1 R8.2
$1N5642: C9.2 U12.4(VCC-/GND)
$1N5727: RELAY2.7 U8.2
$1N5749: RELAY2.5 U10.2
$1N5761: RELAY2.2 U8.3
$1N5833: R3.1 RELAY2.6
$1N6041: R11.1 U9.2
$1N6045: R9.2 R11.2 U13.3(IN1+)
$1N6052: R12.1 U9.3
$1N6056: R10.2 R12.2 U13.2(IN1-)
$1N6179: R13.1 U11.2
$1N6296: R14.1 U11.3
$1N6300: R14.2 R16.2 U13.6(IN2-)
$1N6309: R13.2 R15.1 U13.5(IN2+)
$1N7688: D2.1(C) Q2.3(C) RELAY2.8
$1N7799: D1.1(C) Q3.3(C) RELAY1.8
$1N8702: C20.2 U3.4(CAPM)
$1N8779: C21.2 U3.5(VNEG)
$1N8919: C24.2 U3.2(CAPP)
$1N8923: C24.1 U3.3(CPGND)
$1N11443: C28.1 U3.18(LDOO)
$1N12418: R27.2 U14.3(IN1+)
$1N12445: R26.1 R28.2 U14.2(IN1-)
$1N12526: R29.2 R30.1 U14.6(IN2-)
$1N12984: C32.1 R30.2 U14.7(OUT2)
$1N13602: R31.1 R33.2 U19.2(IN1-)
$1N13611: C35.1 R31.2 U19.1(OUT1)
$1N13618: R32.2 U19.3(IN1+)
$1N13634: C36.1 R35.2 U19.7(OUT2)
$1N13638: R34.2 R35.1 U19.6(IN2-)
$1N17594: R38.2 USBC1.A5(CC1)
$1N17598: R39.2 USBC1.B5(CC2)
$1N18129: Q5.1(B) R36.2
$1N18189: Q4.1(B) R37.2
$1N18988: LED1.2(K) R42.1
$1N19092: D3.2(A) U6.1
$1N40597: R5.1 RELAY2.3
$1N40603: RELAY2.4 U10.3

Not connected (* = marked no-connect by the designer): U1 4(SENSOR_VP) 5(SENSOR_VN) 6(IO34) 7(IO35) 8(IO32) 9(IO33) 16(IO13) 17(SD2) 18(SD3) 19(CMD) 21(SD0) 22(SD1) 23(IO15) 24(IO2) 29(IO5) 30(IO18) 32(NC) 37(IO23); U20 7(NC.) 8(OUT#) 9(CTS#) 10(DSR#) 11(RI#) 12(DCD#) 15(R232); USBC1 A8(SBU1) B8(SBU2)
